# Altium schematic sheet Motor Controller.SchDoc
size A
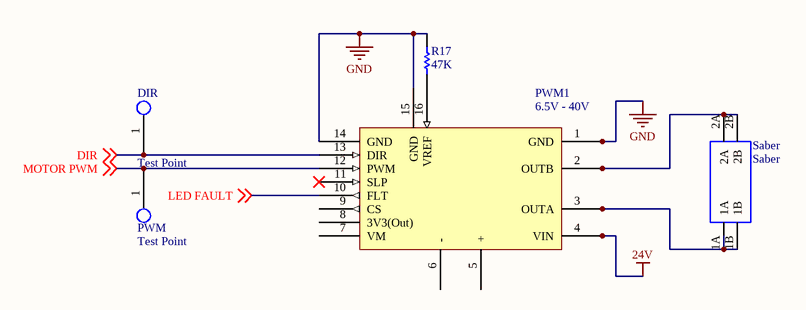
[diagram p0: Motor Controller.SchDoc]

## Parts
DIR  Test Point  [Test Point Through-hole]
PWM  Test Point  [Test Point Through-hole]
PWM1  6.5V - 40V  [Pololu_G2_Driver_24v21]
R17  47K  [RESC0805(2012)_N]
Saber  Saber  [Saber]

## Nets
24V: PWM1.4(VIN) PWM1.4a(VIN) PWM1.4b(VIN)
GND: PWM1.1(GND) PWM1.1a(GND) PWM1.1b(GND) PWM1.14(GND) PWM1.15(GND) R17.2
DIR: DIR.1 PWM1.13(DIR) ; off-sheet DIR
LED FAULT: PWM1.10(FLT) ; off-sheet LED FAULT
MOTOR PWM: PWM.1 PWM1.12(PWM) ; off-sheet MOTOR PWM
NetPWM1_2: PWM1.2(OUTB) PWM1.2a(OUTB) PWM1.2b(OUTB) Saber.2A Saber.2B
NetPWM1_3: PWM1.3(OUTA) PWM1.3a(OUTA) PWM1.3b(OUTA) Saber.1A Saber.1B
NetPWM1_16: PWM1.16(VREF) R17.1

Not connected (* = marked no-connect by the designer): PWM1 5(+) 6(-) 7(VM) 8(3V3(Out)) 9(CS) 11(SLP)*

## Library data of the parts
PWM1 = Pololu G2 High-Power Motor Driver 24v21: This discrete MOSFET H-bridge motor driver enables bidirectional control of one high-power DC brushed motor. The small 1.3″ × 0.8″ board supports a wide 6.5 V to 40 V voltage range and is efficient enough to deliver a continuous 21 A without a heat sink. Additional features of this second-generation (G2) driver include reverse-voltage protection along with basic current sensing and current limiting functionality.; ComponentLink1Description: Product Info; ComponentLink1URL: https://www.pololu.com/product/2995/specs
R17 = 120R 5% 0805: 120R 0.125W 5% 0805 (2012 Metric)  SMD; Case-Metric: 2012; Value: 120.00 Ohm; Case-EIA: 0805; Tolerance: 5 %; Technology: SMT; Power: 0.125 W